# Altium schematic sheet TopSheet.SchDoc
size A4; CompanyName: Technische Hochschule Nürnberg Georg Simon Ohm; Organization: UltraZohm; Address1: Kesslerplatz 12; Address2: 90489 Nürnberg; Address3: GERMANY; DocumentNumber: 2; SheetNumber: 2; SheetTotal: 12; Website: www.ultrazohm.com
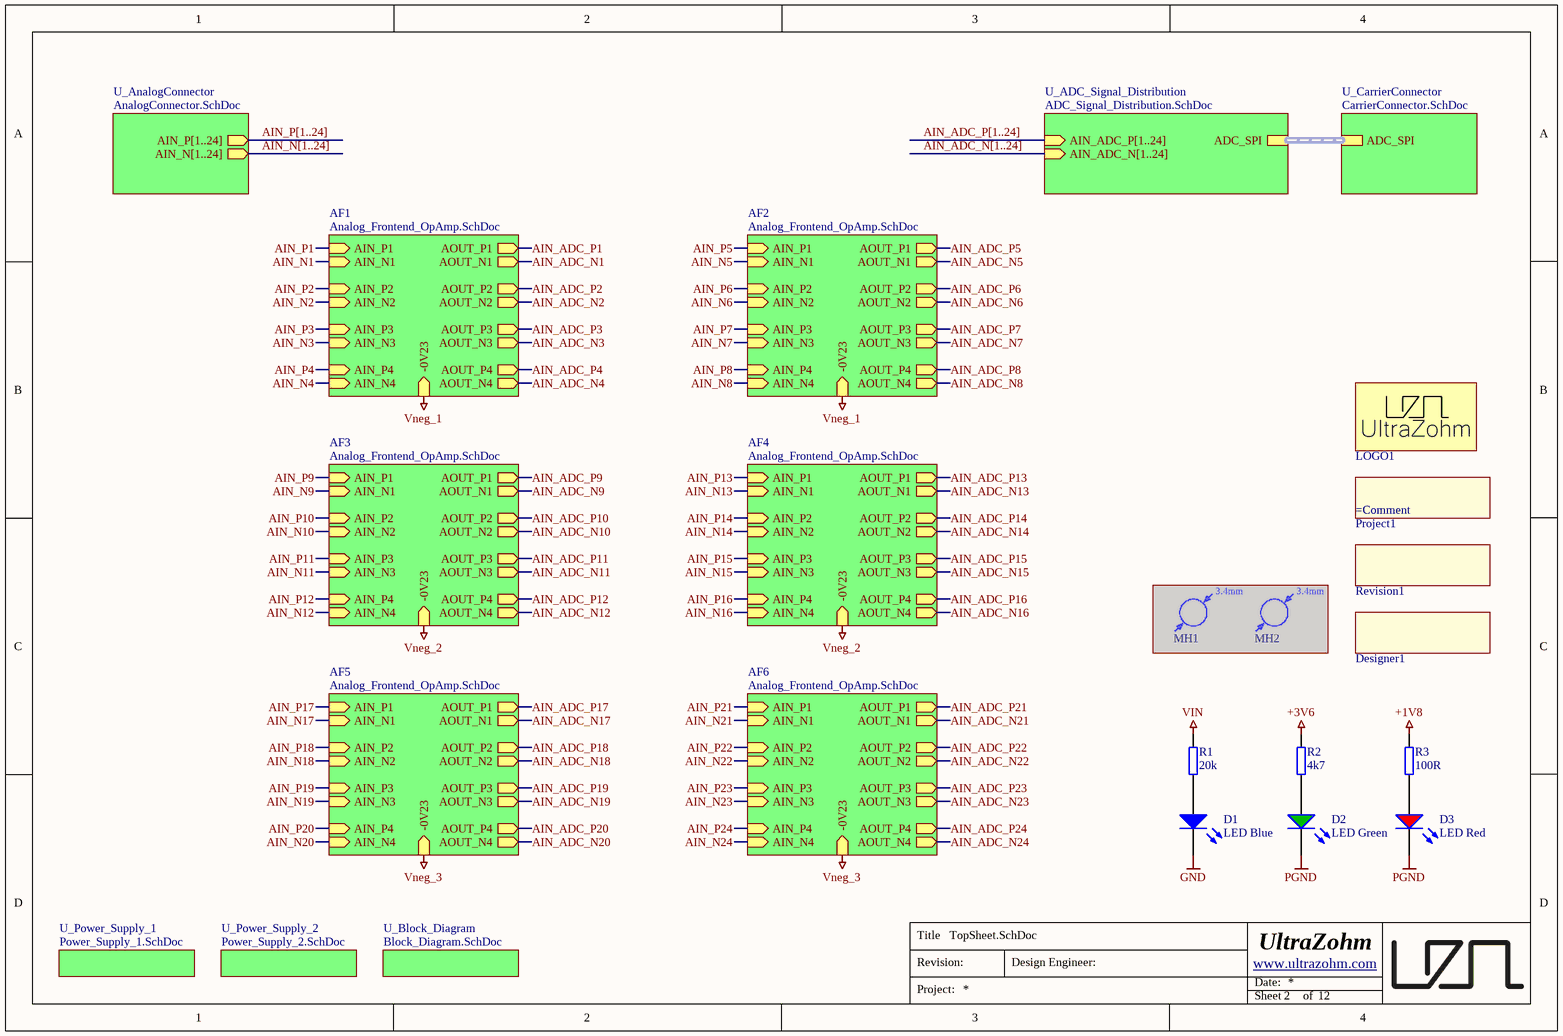
[diagram p0: TopSheet.SchDoc]

## Parts
D1  LED Blue  [WL-SMCW_0603]
D2  LED Green  [WL-SMCW_0603]
D3  LED Red  [WL-SMCW_0603]
Designer1  (no value)  [Designator:comment]  (no BOM)
LOGO1  UZ Logo  [UZ_Logo_small]  (value not drawn)  (no BOM)
MH1  mounting hole 3,4mm  [MH_3.4]  (value not drawn)  (masked out: inside a compile mask, not in the netlist)
MH2  mounting hole 3,4mm  [MH_3.4]  (value not drawn)  (masked out: inside a compile mask, not in the netlist)
Project1  (no value)  [COMMENT]  (no BOM)
R1  20k  [RES 0603_1608]
R2  4k7  [R_0603_TE]
R3  100R  [RES 0603_1608]
Revision1  (no value)  [Designator:comment]  (no BOM)

## Sub-sheets
AF1 = Analog_Frontend_OpAmp.SchDoc: AIN_P1 (in), AIN_N1 (in), AOUT_P1 (out), AOUT_N1 (out), AIN_P2 (in), AIN_N2 (in), AIN_P3 (in), AIN_N3 (in), AIN_P4 (in), AIN_N4 (in), AOUT_P2 (out), AOUT_N2 (out), AOUT_P3 (out), AOUT_N3 (out), AOUT_P4 (out), AOUT_N4 (out), -0V23 (in)
AF2 = Analog_Frontend_OpAmp.SchDoc: AIN_P1 (in), AIN_N1 (in), AOUT_P1 (out), AOUT_N1 (out), AIN_P2 (in), AIN_N2 (in), AIN_P3 (in), AIN_N3 (in), AIN_P4 (in), AIN_N4 (in), AOUT_P2 (out), AOUT_N2 (out), AOUT_P3 (out), AOUT_N3 (out), AOUT_P4 (out), AOUT_N4 (out), -0V23 (in)
AF3 = Analog_Frontend_OpAmp.SchDoc: AIN_P1 (in), AIN_N1 (in), AOUT_P1 (out), AOUT_N1 (out), AIN_P2 (in), AIN_N2 (in), AIN_P3 (in), AIN_N3 (in), AIN_P4 (in), AIN_N4 (in), AOUT_P2 (out), AOUT_N2 (out), AOUT_P3 (out), AOUT_N3 (out), AOUT_P4 (out), AOUT_N4 (out), -0V23 (in)
AF4 = Analog_Frontend_OpAmp.SchDoc: AIN_P1 (in), AIN_N1 (in), AOUT_P1 (out), AOUT_N1 (out), AIN_P2 (in), AIN_N2 (in), AIN_P3 (in), AIN_N3 (in), AIN_P4 (in), AIN_N4 (in), AOUT_P2 (out), AOUT_N2 (out), AOUT_P3 (out), AOUT_N3 (out), AOUT_P4 (out), AOUT_N4 (out), -0V23 (in)
AF5 = Analog_Frontend_OpAmp.SchDoc: AIN_P1 (in), AIN_N1 (in), AOUT_P1 (out), AOUT_N1 (out), AIN_P2 (in), AIN_N2 (in), AIN_P3 (in), AIN_N3 (in), AIN_P4 (in), AIN_N4 (in), AOUT_P2 (out), AOUT_N2 (out), AOUT_P3 (out), AOUT_N3 (out), AOUT_P4 (out), AOUT_N4 (out), -0V23 (in)
AF6 = Analog_Frontend_OpAmp.SchDoc: AIN_P1 (in), AIN_N1 (in), AOUT_P1 (out), AOUT_N1 (out), AIN_P2 (in), AIN_N2 (in), AIN_P3 (in), AIN_N3 (in), AIN_P4 (in), AIN_N4 (in), AOUT_P2 (out), AOUT_N2 (out), AOUT_P3 (out), AOUT_N3 (out), AOUT_P4 (out), AOUT_N4 (out), -0V23 (in)
U_ADC_Signal_Distribution = ADC_Signal_Distribution.SchDoc: AIN_ADC_P[1..24] (in), AIN_ADC_N[1..24] (in), ADC_SPI (harness ADC_SPI)
U_AnalogConnector = AnalogConnector.SchDoc: AIN_P[1..24] (out), AIN_N[1..24] (out)
U_Block_Diagram = Block_Diagram.SchDoc: no entries
U_CarrierConnector = CarrierConnector.SchDoc: ADC_SPI (harness ADC_SPI)
U_Power_Supply_1 = Power_Supply_1.SchDoc: no entries
U_Power_Supply_2 = Power_Supply_2.SchDoc: no entries

## Nets
+1V8: R3.2
+3V6: R2.2
GND: D1.1(K)
PGND: D2.1(K) D3.1(K)
VIN: R1.2
Vneg_1: sheet AF1/-0V23, sheet AF2/-0V23
Vneg_2: sheet AF3/-0V23, sheet AF4/-0V23
Vneg_3: sheet AF5/-0V23, sheet AF6/-0V23
AIN_ADC_N1: sheet AF1/AOUT_N1
AIN_ADC_N2: sheet AF1/AOUT_N2
AIN_ADC_N3: sheet AF1/AOUT_N3
AIN_ADC_N4: sheet AF1/AOUT_N4
AIN_ADC_N5: sheet AF2/AOUT_N1
AIN_ADC_N6: sheet AF2/AOUT_N2
AIN_ADC_N7: sheet AF2/AOUT_N3
AIN_ADC_N8: sheet AF2/AOUT_N4
AIN_ADC_N9: sheet AF3/AOUT_N1
AIN_ADC_N10: sheet AF3/AOUT_N2
AIN_ADC_N11: sheet AF3/AOUT_N3
AIN_ADC_N12: sheet AF3/AOUT_N4
AIN_ADC_N13: sheet AF4/AOUT_N1
AIN_ADC_N14: sheet AF4/AOUT_N2
AIN_ADC_N15: sheet AF4/AOUT_N3
AIN_ADC_N16: sheet AF4/AOUT_N4
AIN_ADC_N17: sheet AF5/AOUT_N1
AIN_ADC_N18: sheet AF5/AOUT_N2
AIN_ADC_N19: sheet AF5/AOUT_N3
AIN_ADC_N20: sheet AF5/AOUT_N4
AIN_ADC_N21: sheet AF6/AOUT_N1
AIN_ADC_N22: sheet AF6/AOUT_N2
AIN_ADC_N23: sheet AF6/AOUT_N3
AIN_ADC_N24: sheet AF6/AOUT_N4
AIN_ADC_P1: sheet AF1/AOUT_P1
AIN_ADC_P2: sheet AF1/AOUT_P2
AIN_ADC_P3: sheet AF1/AOUT_P3
AIN_ADC_P4: sheet AF1/AOUT_P4
AIN_ADC_P5: sheet AF2/AOUT_P1
AIN_ADC_P6: sheet AF2/AOUT_P2
AIN_ADC_P7: sheet AF2/AOUT_P3
AIN_ADC_P8: sheet AF2/AOUT_P4
AIN_ADC_P9: sheet AF3/AOUT_P1
AIN_ADC_P10: sheet AF3/AOUT_P2
AIN_ADC_P11: sheet AF3/AOUT_P3
AIN_ADC_P12: sheet AF3/AOUT_P4
AIN_ADC_P13: sheet AF4/AOUT_P1
AIN_ADC_P14: sheet AF4/AOUT_P2
AIN_ADC_P15: sheet AF4/AOUT_P3
AIN_ADC_P16: sheet AF4/AOUT_P4
AIN_ADC_P17: sheet AF5/AOUT_P1
AIN_ADC_P18: sheet AF5/AOUT_P2
AIN_ADC_P19: sheet AF5/AOUT_P3
AIN_ADC_P20: sheet AF5/AOUT_P4
AIN_ADC_P21: sheet AF6/AOUT_P1
AIN_ADC_P22: sheet AF6/AOUT_P2
AIN_ADC_P23: sheet AF6/AOUT_P3
AIN_ADC_P24: sheet AF6/AOUT_P4
AIN_N1: sheet AF1/AIN_N1
AIN_N2: sheet AF1/AIN_N2
AIN_N3: sheet AF1/AIN_N3
AIN_N4: sheet AF1/AIN_N4
AIN_N5: sheet AF2/AIN_N1
AIN_N6: sheet AF2/AIN_N2
AIN_N7: sheet AF2/AIN_N3
AIN_N8: sheet AF2/AIN_N4
AIN_N9: sheet AF3/AIN_N1
AIN_N10: sheet AF3/AIN_N2
AIN_N11: sheet AF3/AIN_N3
AIN_N12: sheet AF3/AIN_N4
AIN_N13: sheet AF4/AIN_N1
AIN_N14: sheet AF4/AIN_N2
AIN_N15: sheet AF4/AIN_N3
AIN_N16: sheet AF4/AIN_N4
AIN_N17: sheet AF5/AIN_N1
AIN_N18: sheet AF5/AIN_N2
AIN_N19: sheet AF5/AIN_N3
AIN_N20: sheet AF5/AIN_N4
AIN_N21: sheet AF6/AIN_N1
AIN_N22: sheet AF6/AIN_N2
AIN_N23: sheet AF6/AIN_N3
AIN_N24: sheet AF6/AIN_N4
AIN_P1: sheet AF1/AIN_P1
AIN_P2: sheet AF1/AIN_P2
AIN_P3: sheet AF1/AIN_P3
AIN_P4: sheet AF1/AIN_P4
AIN_P5: sheet AF2/AIN_P1
AIN_P6: sheet AF2/AIN_P2
AIN_P7: sheet AF2/AIN_P3
AIN_P8: sheet AF2/AIN_P4
AIN_P9: sheet AF3/AIN_P1
AIN_P10: sheet AF3/AIN_P2
AIN_P11: sheet AF3/AIN_P3
AIN_P12: sheet AF3/AIN_P4
AIN_P13: sheet AF4/AIN_P1
AIN_P14: sheet AF4/AIN_P2
AIN_P15: sheet AF4/AIN_P3
AIN_P16: sheet AF4/AIN_P4
AIN_P17: sheet AF5/AIN_P1
AIN_P18: sheet AF5/AIN_P2
AIN_P19: sheet AF5/AIN_P3
AIN_P20: sheet AF5/AIN_P4
AIN_P21: sheet AF6/AIN_P1
AIN_P22: sheet AF6/AIN_P2
AIN_P23: sheet AF6/AIN_P3
AIN_P24: sheet AF6/AIN_P4
NetD1_2: D1.2(A) R1.1
NetD2_2: D2.2(A) R2.1
NetD3_2: D3.2(A) R3.1

## Buses and harness runs
bus AIN_ADC_N[1..24] = sheet U_ADC_Signal_Distribution/AIN_ADC_N[1..24]
bus AIN_ADC_P[1..24] = sheet U_ADC_Signal_Distribution/AIN_ADC_P[1..24]
bus AIN_N[1..24] = sheet U_AnalogConnector/AIN_N[1..24]
bus AIN_P[1..24] = sheet U_AnalogConnector/AIN_P[1..24]
harness sheet U_ADC_Signal_Distribution/ADC_SPI = sheet U_CarrierConnector/ADC_SPI

## Notes on the sheet
- Title
- Revision:
- Design Engineer:
- Date:
- Project:
- Sheet
- of
- (in symbol Mounting Hole) 3.4mm

## Library data of the parts
D1 = 19-217/BHC-ZL1M2RY/3T: LED BLUE 465~475NM 11.5~28.5MCD@5MA TOP VIEW 0603 ROHS; Manufacturer: Everlight Elec; Type: Standard; Created from: T. Wendt; Forward Current I_f: 20 mA; Forward Voltage U_f: 2.8 V; Wavelength: 470 nm; Nominal Power: 68 mW; Manufacturer Part Number: 19-217/BHC-ZL1M2RY/3T; PartID: 6; Created On: 03.03.2021 09:59:51; ComponentLink1Description: Datasheet; ComponentLink1URL: https://datasheet.lcsc.com/szlcsc/Everlight-Elec-19-217-BHC-ZL1M2RY-3T_C72041.pdf; Component Type: LED Diode; Device Package: 0603; Last Updated: 04.03.2021 09:02:49; Mounting Type: SMD; Operating Temperature: -40 - 85 °C; Supplier 1: LCSC; Supplier Part Number 1: C72041; Live Cycle Status: 1; Stock number: not stored; Color: blue; Light Intensity: 28.5 mcd; LCSC Part Number: C72041
D2 = 19-217/GHC-YR1S2/3T: LED GREEN 520~535NM 112~258MCD@20MA TOP VIEW 0603 ROHS; Manufacturer: Everlight Elec; Type: Standard; Created from: T. Wendt; Forward Current I_f: 20 mA; Forward Voltage U_f: 3.3 V; Wavelength: 530 nm; Light Intensity: 285 mcd; Nominal Power: 83 mW; Manufacturer Part Number: 19-217/GHC-YR1S2/3T; PartID: 7; Created On: 03.03.2021 10:06:23; ComponentLink1Description: Datasheet; ComponentLink1URL: https://datasheet.lcsc.com/szlcsc/Everlight-Elec-19-217-GHC-YR1S2-3T_C72043.pdf; Component Type: LED Diode; Device Package: 0603; Last Updated: 04.03.2021 09:02:49; Mounting Type: SMD; Operating Temperature: -40 - 85 °C; Supplier 1: LCSC; Supplier Part Number 1: C72043; Supplier 2: Mouser; Supplier Part Number 2: 638-19217GHCYR1S23T; Live Cycle Status: 1; Stock number: not stored; Color: green; LCSC Part Number: C72043
D3 = KT-0603R: LED RED 520~625NM 90~100MCD@20MA TOP VIEW 0603 ROHS; Manufacturer: Hubei KENTO Elec; Type: Standard; Created from: T. Wendt; Forward Current I_f: 20 mA; Forward Voltage U_f: 2.1 V; Wavelength: 620 nm; Light Intensity: 110 mcd; Nominal Power: 42 mW; Manufacturer Part Number: KT-0603R; PartID: 8; Created On: 03.03.2021 10:06:23; ComponentLink1Description: Datasheet; ComponentLink1URL: https://datasheet.lcsc.com/szlcsc/Hubei-KENTO-Elec-KT-0603R_C2286.pdf; Component Type: LED Diode; Device Package: 0603; Last Updated: 04.03.2021 09:02:49; Mounting Type: SMD; Operating Temperature: -40 - 85 °C; Supplier 1: LCSC; Supplier Part Number 1: C2286; Live Cycle Status: 1; Stock number: not stored; Color: red; LCSC Part Number: C2286
Designer1 = 4: Create a project parameter named "Author" this is the value of this component. It is printed on the PCB. Once the parameter is updated (e.g. new revision) it gets updated on the PCB as well; Manufacturer: PCB Manufacturer; Manufacturer Part Number: Project Author; Created from: T. Wendt; PartID: 4; Created On: 01.03.2021 08:53:41; Component Type: Project Author; Last Updated: 01.03.2021 09:20:27; Type: Standard (No BOM); Value: =AuthorParam; Live Cycle Status: 1
LOGO1 = 1: Official Project Logo of the UltraZohm; Manufacturer: PCB Manufacturer; Manufacturer Part Number: UltraZohm Logo; Created from: T. Wendt; PartID: 1; Created On: 19.02.2021 16:55:56; ComponentLink1Description: Homepage; ComponentLink1URL: https://ultrazohm.com; Component Type: Logo; Last Updated: 02.03.2021 14:31:24; Type: Standard (No BOM); Live Cycle Status: 1
MH1 MH2 = Mounting Hole: Non plated through hole, 3.4mm
Project1 = 2: Create a project parameter named "ProjectNameCustom" this is the value of this component and it is printed on the PCB.; Manufacturer: PCB Manufacturer; Created from: T. Wendt; PartID: 2; Created On: 01.03.2021 08:43:57; Component Type: Project Name; Last Updated: 01.03.2021 09:07:27; Manufacturer Part Number: Project Name; Type: Standard (No BOM); Value: =ProjectNameCustom; Live Cycle Status: 1
R1 = 0603WAF2002T5E: SMD resistor E24 series; Manufacturer: UNI-ROYAL; Tolerance: 1%; Created from: AGeiger; Manufacturer Part Number: 0603WAF2002T5E; PartID: 105; Created On: 14.12.2020 16:17:14; ComponentLink1Description: Datasheet; ComponentLink1URL: https://datasheet.lcsc.com/lcsc/2206010230_UNI-ROYAL-Uniroyal-Elec-0603WAF2002T5E_C4184.pdf; Component Type: SMD resistor; Device Package: 0603; Last Updated: 25.08.2022 20:05:50; Mounting Type: SMD; Supplier 1: LCSC; Supplier Part Number 1: C4184; Type: Resistor; Value: 20k; Live Cycle Status: 1; Stock number: Labor SMD Container; LCSC Part Number: C4184
R2 = UZgen_R_0603_4k7: Generic resistor; Manufacturer: UZgen; Tolerance: 1 %; Created from: UZgenTool; Manufacturer Part Number: UZgen_R_0603_4k7; PartID: 237; Created On: 02.07.2024 17:29:50; Device Package: 0603; Last Updated: 02.07.2024 17:29:50; Mounting Type: SMD; Value: 4k7
R3 = RK73B1JTTD101J: SMD resistor E24 series; Manufacturer: KOA Speer; Tolerance: 5%; Created from: MGremer; Manufacturer Part Number: RK73B1JTTD101J; PartID: 50; Created On: 14.12.2020 16:17:14; ComponentLink1Description: Datasheet; ComponentLink1URL: https://www.mouser.de/datasheet/2/219/RK73B-1825463.pdf; Component Type: SMD resistor; Device Package: 0603; Last Updated: 29.11.2022 14:30:07; Mounting Type: SMD; Supplier 1: Mouser; Supplier Part Number 1: 660-RK73B1JTTD101J; Type: Resistor; Value: 100R; Live Cycle Status: 1; Stock number: Labor SMD Container; LCSC Part Number: C22775; Supplier 2: LCSC; Supplier Part Number 2: C22775
Revision1 = 3: Create a project parameter named "ProjectRevision" this is the value of this component. It is printed on the PCB. Once the parameter is updated (e.g. new revision) it gets updated on the PCB as well; Manufacturer: PCB Manufacturer; Created from: T. Wendt; PartID: 3; Created On: 01.03.2021 08:50:34; Component Type: Project Revision; Last Updated: 01.03.2021 09:28:36; Manufacturer Part Number: Project Revision; Type: Standard (No BOM); Value: =ProjectRevision; Live Cycle Status: 1